# EAGLE design pcb1 (EAGLE 6.5.0)
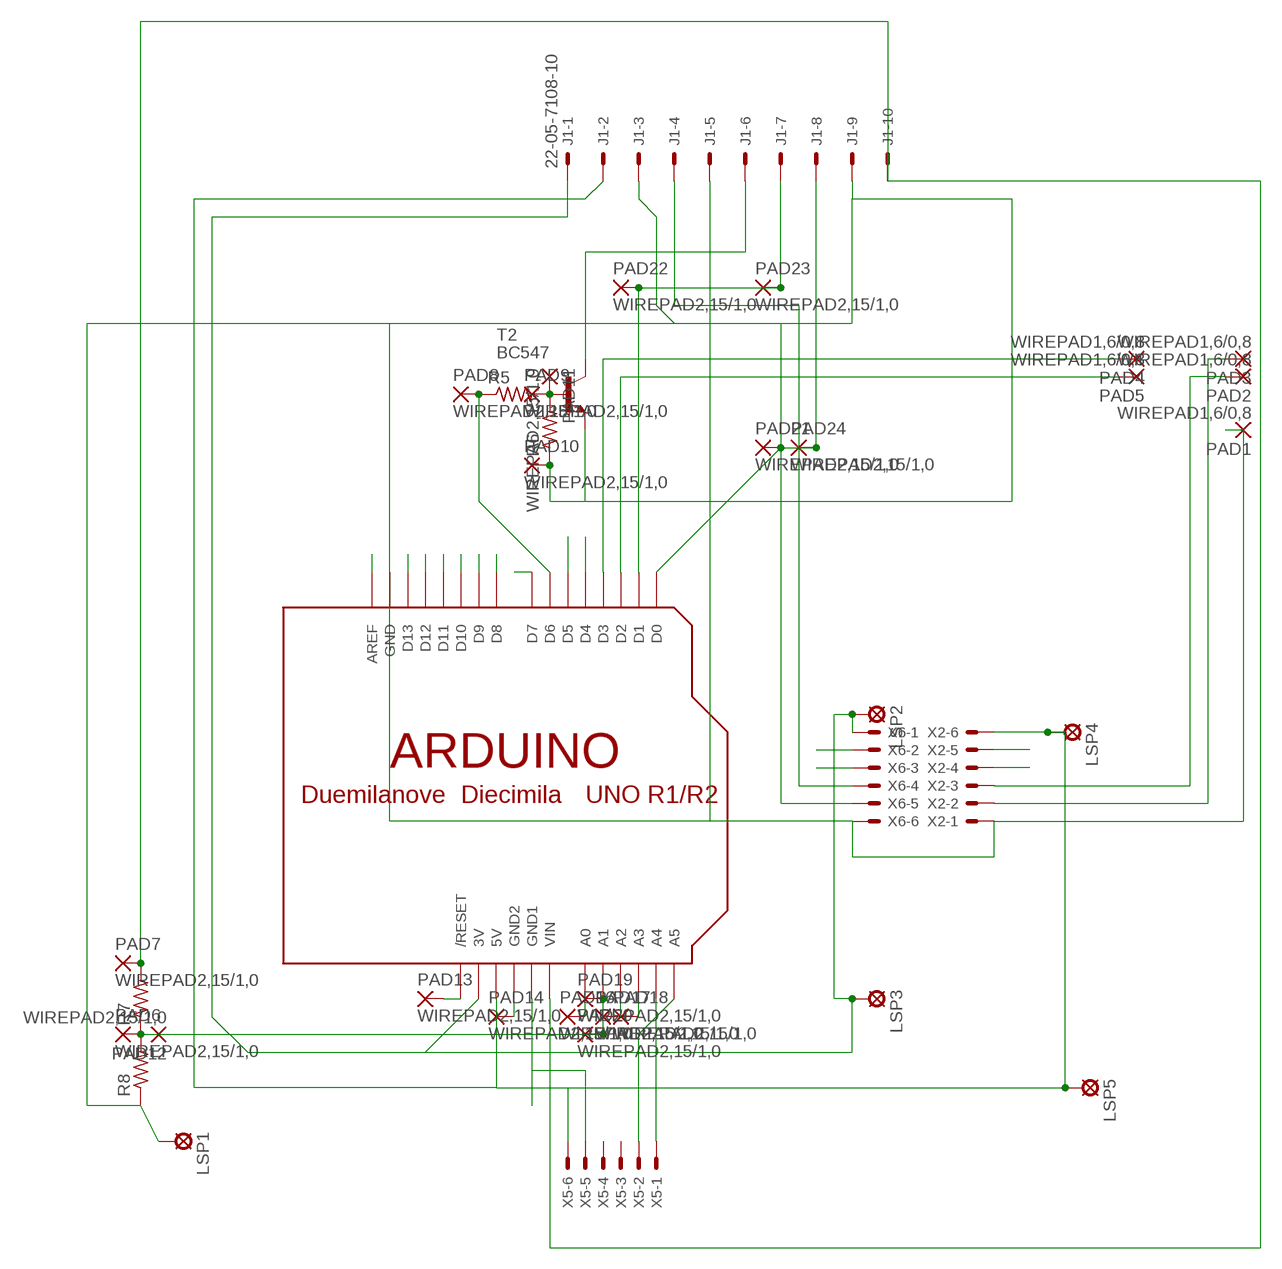
[diagram p0: schematic, sheet 1]

## Parts
J1  22-05-7108-10  [7395-10]
LSP1  LSP10  [LSP10]
LSP2  LSP10  [LSP10]
LSP3  LSP10  [LSP10]
LSP4  LSP10  [LSP10]
LSP5  LSP10  [LSP10]
PAD1  WIREPAD1,6/0,8  [1,6/0,8]
PAD2  WIREPAD1,6/0,8  [1,6/0,8]
PAD3  WIREPAD1,6/0,8  [1,6/0,8]
PAD4  WIREPAD1,6/0,8  [1,6/0,8]
PAD5  WIREPAD1,6/0,8  [1,6/0,8]
PAD6  WIREPAD2,15/1,0  [2,15/1,0]
PAD7  WIREPAD2,15/1,0  [2,15/1,0]
PAD8  WIREPAD2,15/1,0  [2,15/1,0]
PAD9  WIREPAD2,15/1,0  [2,15/1,0]
PAD10  WIREPAD2,15/1,0  [2,15/1,0]
PAD11  WIREPAD2,15/1,0  [2,15/1,0]
PAD12  WIREPAD2,15/1,0  [2,15/1,0]
PAD13  WIREPAD2,15/1,0  [2,15/1,0]
PAD14  WIREPAD2,15/1,0  [2,15/1,0]
PAD16  WIREPAD2,15/1,0  [2,15/1,0]
PAD17  WIREPAD2,15/1,0  [2,15/1,0]
PAD18  WIREPAD2,15/1,0  [2,15/1,0]
PAD19  WIREPAD2,15/1,0  [2,15/1,0]
PAD20  WIREPAD2,15/1,0  [2,15/1,0]
PAD21  WIREPAD2,15/1,0  [2,15/1,0]
PAD22  WIREPAD2,15/1,0  [2,15/1,0]
PAD23  WIREPAD2,15/1,0  [2,15/1,0]
PAD24  WIREPAD2,15/1,0  [2,15/1,0]
R5  R-US_0207/10  [0207/10]
R6  R-US_0207/10  [0207/10]
R7  R-US_0207/10  [0207/10]
R8  R-US_0207/10  [0207/10]
T2  BC547  [TO92]
U$1  ARDUINO-NODIM  [ARDUINO-NODIM]
X2  22-23-2061  [22-23-2061]
X5  22-23-2061  [22-23-2061]
X6  22-23-2061  [22-23-2061]

## Nets
N$1: U$1.GND1 X5.5
N$2: U$1.A5 X5.2
N$3: U$1.A4 X5.1
N$4: J1.6 T2.3(C)
N$8: PAD16.1(P) U$1.A0
N$9: PAD17.1(P) U$1.A2
N$10: PAD18.1(P) U$1.A3
N$11: J1.5 J1.9 LSP1.MP PAD1.1(P) PAD10.1(P) R6.1 R8.1 T2.1(E) U$1.GND X2.1 X6.6
N$12: U$1.D5
N$13: U$1.D7
N$14: PAD6.1(P) PAD12.1(P) PAD19.1(P) PAD20.1(P) R7.1 R8.2 U$1.A1
N$15: U$1.AREF
N$16: U$1.D13
N$18: J1.2 LSP4.MP LSP5.MP U$1.5V X2.6 X5.6
N$19: PAD4.1(P) U$1.D3
N$20: J1.1 LSP2.MP LSP3.MP U$1.3V X6.1
N$21: PAD5.1(P) U$1.D2
N$22: X6.3
N$23: X6.2
N$24: X2.5
N$25: J1.8 PAD21.1(P) PAD24.1(P) U$1.D0
N$26: J1.7 PAD22.1(P) PAD23.1(P) U$1.D1
N$27: PAD9.1(P) PAD11.1(P) R5.2 R6.2 T2.2(B)
N$28: X2.4
N$29: PAD8.1(P) R5.1 U$1.D6
N$30: U$1.D4
N$37: J1.4 X6.4
N$38: J1.3 X6.5
N$43: U$1.D12
N$44: U$1.D11
N$45: U$1.D10
N$46: U$1.D9
N$47: U$1.D8
N$48: PAD13.1(P) U$1.RESET(/RESET)
N$49: PAD14.1(P) U$1.GND2
N$50: J1.10 PAD7.1(P) R7.2 U$1.VIN
N$58: PAD2.1(P) X2.3
N$59: PAD3.1(P) X2.2
Unconnected: X5.3 X5.4

## Library data of the parts
J1 = con-molex:22-?-10: CONNECTOR wire to board 2.54 mm (.1 inch) pitch header; OC_FARNELL: unknown; OC_NEWARK: unknown
LSP1-LSP5 = solpad:LSP10: SOLDER PAD drill 1.0 mm, distributor Buerklin, 12H555
PAD1-PAD14 PAD16-PAD24 = wirepad:WIREPAD: Wire PAD connect wire on PCB
R5-R8 = rcl:R-US_: RESISTOR, American symbol
T2 = transistor-neu-to92:BC547: NPN TRANSISTOR
U$1 = adafruit:ARDUINO: Arduino Diecimila/Duemilanove Make a shield with ease, this package has all the named pins as well as the two mounting drill holes and an outline of the USB and DC power connector. The outline is on the DIMENSION layer, so if your board house uses it they will cut the outline to match. http://www.ladyada.net/library/pcb/eaglelibrary.html
X2 X5 X6 = con-molex:22-23-2061: .100" (2.54mm) Center Header - 6 Pin; MF: MOLEX; MPN: 22-23-2061; OC_FARNELL: 1462922; OC_NEWARK: 27C1933

## Net classes
0 default: clearance 0.205 mm

## Board
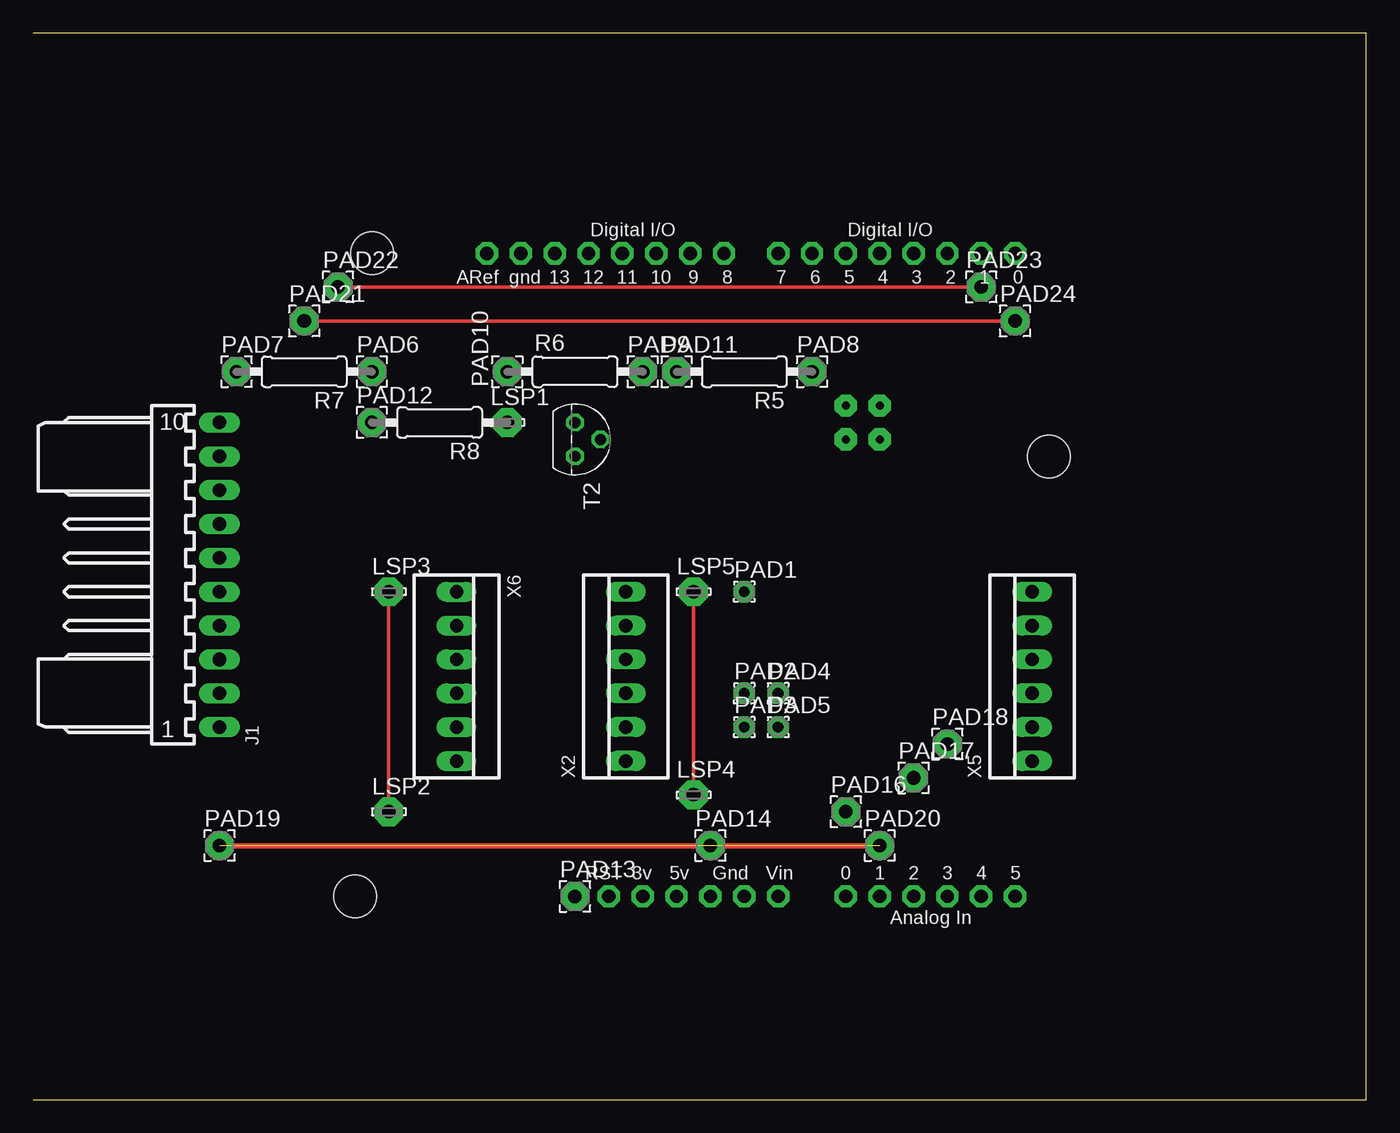
[diagram p1: board, top side]
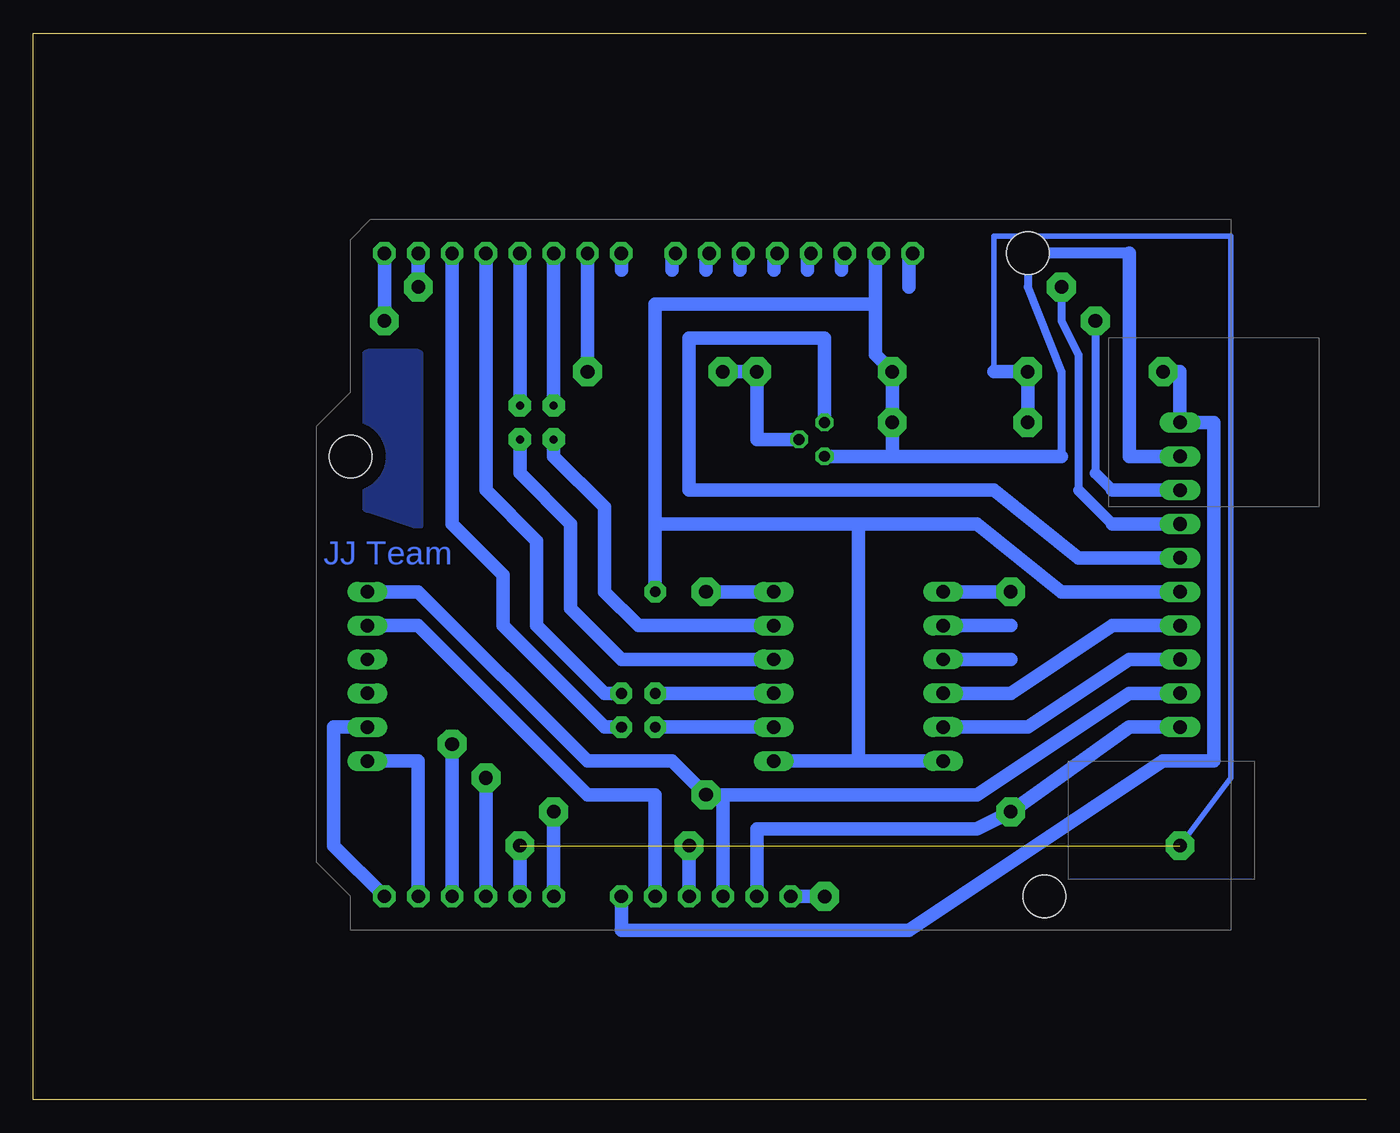
[diagram p2: board, bottom side, seen from below]

Size 100 x 80 mm. Coordinates in mm from the lower left corner, seen from the top.
Outline: 0,0 100,0 100,80 0,80
Copper layers (1*16): Top 0.035mm / dielectric 1.5mm / Bottom 0.035mm
Design rules "default": minimum track width 10mil, minimum drill 24mil, track to track 8mil, track to pad 8mil, pad to pad 8mil, via to via 8mil, smd to smd 8mil, copper to edge 40mil, drill to drill 8mil, minimum pad ring 10mil, minimum via ring 8mil, stop-mask expansion 4mil, vias tented up to drill 0mil, thermal gap 10mil

### Footprints (pad centres in the part's own frame; a part is rotated, then mirrored left to right if it is on the bottom)
7395-10 = drill 1.016 long: 1 11.43,0; 2 8.89,0; 3 6.35,0; 4 3.81,0; 5 1.27,0; 6 -1.27,0; 7 -3.81,0; 8 -6.35,0; 9 -8.89,0; 10 -11.43,0
LSP10 = drill 1.016 pad 2.159 octagon: MP 0,0
1,6/0,8 = drill 0.813 pad 1.6 octagon: 1 0,0
2,15/1,0 = drill 1.016 pad 2.159 octagon: 1 0,0
0207/10 = drill 0.813 octagon: 1 -5.08,0; 2 5.08,0
TO92 = drill 0.813 octagon: 1 1.27,0; 2 0,1.905; 3 -1.27,0
ARDUINO-NODIM = drill 1 pad 1.676 octagon: 3V 35.56,2.54; 5V 38.1,2.54; A0 50.8,2.54; A1 53.34,2.54; A2 55.88,2.54; A3 58.42,2.54; A4 60.96,2.54; A5 63.5,2.54; AREF 23.876,50.8; D0 63.5,50.8; D1 60.96,50.8; D2 58.42,50.8; D3 55.88,50.8; D4 53.34,50.8; D5 50.8,50.8; D6 48.26,50.8; D7 45.72,50.8; D8 41.656,50.8; D9 39.116,50.8; D10 36.576,50.8; D11 34.036,50.8; D12 31.496,50.8; D13 28.956,50.8; GND 26.416,50.8; GND1 43.18,2.54; GND2 40.64,2.54; RESET 33.02,2.54; VIN 45.72,2.54 | hole 3.2: 15.24,50.8; 66.04,35.56; 13.97,2.54
22-23-2061 = drill 1 long: 1 -6.35,0; 2 -3.81,0; 3 -1.27,0; 4 1.27,0; 5 3.81,0; 6 6.35,0

### Placement (x,y rotation side)
J1  13.97,39.37 270 top
LSP1  35.56,50.8 0 top
LSP2  26.67,21.59 0 top
LSP3  26.67,38.1 0 top
LSP4  49.53,22.86 0 top
LSP5  49.53,38.1 0 top
PAD1  53.34,38.1 0 top
PAD2  53.34,30.48 0 top
PAD3  53.34,27.94 0 top
PAD4  55.88,30.48 0 top
PAD5  55.88,27.94 0 top
PAD6  25.4,54.61 0 top
PAD7  15.24,54.61 0 top
PAD8  58.42,54.61 0 top
PAD9  45.72,54.61 0 top
PAD10  35.56,54.61 90 top
PAD11  48.26,54.61 0 top
PAD12  25.4,50.8 0 top
PAD13  40.64,15.24 0 top
PAD14  50.8,19.05 0 top
PAD16  60.96,21.59 0 top
PAD17  66.04,24.13 0 top
PAD18  68.58,26.67 0 top
PAD19  13.97,19.05 0 top
PAD20  63.5,19.05 0 top
PAD21  20.32,58.42 0 top
PAD22  22.86,60.96 0 top
PAD23  71.12,60.96 0 top
PAD24  73.66,58.42 0 top
R5  53.34,54.61 180 top
R6  40.64,54.61 0 top
R7  20.32,54.61 180 top
R8  30.48,50.8 180 top
T2  40.64,49.53 270 top
U$1  10.16,12.7 0 top
X2  44.45,31.75 90 top
X5  74.93,31.75 90 top
X6  31.75,31.75 270 top

### Tracks (layer width: path | path; a pad name or v marks a point on that pad's centre or on a via)
N$1
  Bottom 1.016: X5.5 71.12,35.56 58.42,22.86 53.34,22.86 U$1.GND1
N$2
  Bottom 1.016: X5.2 77.47,27.94 77.47,19.05 U$1.A5
N$3
  Bottom 1.016: X5.1 71.12,25.4 U$1.A4
N$4
  Bottom 1.016: T2.3 40.64,57.15 50.8,57.15 50.8,45.72 27.94,45.72 21.59,40.64 J1.6
N$8  (via drill 0.6)
  Bottom 1.016: PAD16.1 U$1.A0
  other vias: 60.96,21.59
N$9  (via drill 0.6)
  Bottom 1.016: PAD17.1 U$1.A2
  other vias: 66.04,24.13
N$10  (via drill 0.6)
  Bottom 1.016: PAD18.1 U$1.A3
  other vias: 68.58,26.67
N$11
  Bottom 0.254: 36.83,63.5 U$1.GND
  Bottom 0.61: 25.4,63.5 25.4,60.96 22.86,54.61 22.86,48.26
  Bottom 0.813: 17.78,63.5 25.4,63.5
  Bottom 1.016: X2.1 38.1,25.4 | 38.1,25.4 X6.6 | 38.1,43.18 53.34,43.18 | 36.83,59.69 36.83,63.5 | 36.83,59.69 53.34,59.69 53.34,43.18 | PAD1.1 53.34,43.18 | 38.1,43.18 38.1,25.4 | J1.5 22.86,38.1 29.21,43.18 38.1,43.18 | J1.9 17.78,48.26 17.78,63.5 | 22.86,48.26 35.56,48.26 | 35.56,48.26 LSP1.MP PAD10.1 36.83,55.88 36.83,59.69 | 35.56,48.26 T2.1
N$12  (via drill 0.6, 0.6 pad 1.68)
  Bottom 1.016: v60.96,52.07 U$1.D5
N$13
  Bottom 1.016: 55.88,62.23 U$1.D7
N$14  (via drill 0.6)  (2 unrouted)
  Top 0.406: PAD20.1 PAD19.1
  Bottom 0.406: 27.94,54.61 27.94,64.77 10.16,64.77 10.16,24.13 PAD19.1
  Bottom 1.016: PAD20.1 U$1.A1 | PAD12.1 PAD6.1 27.94,54.61
  other vias: 63.5,19.05 13.97,19.05
N$18  (via drill 0.6)
  Top 0.254: LSP4.MP LSP5.MP
  Bottom 1.016: U$1.5V 48.26,22.86 | X5.6 71.12,38.1 58.42,25.4 52.07,25.4 LSP4.MP 48.26,22.86 | J1.2 17.78,30.48 29.21,22.86 48.26,22.86 | LSP5.MP X2.6
  other vias: 49.53,22.86 49.53,38.1
N$19
  Bottom 1.016: PAD4.1 57.15,30.48 62.23,35.56 62.23,41.91 66.04,45.72 U$1.D3
N$20  (via drill 0.6)
  Top 0.254: LSP2.MP LSP3.MP
  Bottom 1.016: LSP3.MP X6.1 | J1.1 17.78,27.94 LSP2.MP 29.21,20.32 45.72,20.32 U$1.3V
  other vias: 26.67,21.59 26.67,38.1
N$21
  Bottom 1.016: U$1.D2 68.58,43.18 64.77,39.37 64.77,35.56 57.15,27.94 PAD5.1
N$22
  Bottom 1.016: 26.67,33.02 X6.3
N$23
  Bottom 1.016: X6.2 26.67,35.56
N$24  (via drill 0.6, 0.6 pad 1.68)
  Bottom 1.016: X2.5 54.61,35.56 57.15,38.1 57.15,44.45 60.96,48.26 v60.96,49.53
N$25  (via drill 0.6)
  Top 0.254: PAD24.1 PAD21.1
  Bottom 0.61: PAD21.1 20.32,46.99
  Bottom 0.813: 20.32,46.99 19.05,45.72
  Bottom 1.016: 19.05,45.72 J1.8 | U$1.D0 PAD24.1
  other vias: 73.66,58.42 20.32,58.42
N$26  (via drill 0.6)
  Top 0.254: PAD23.1 PAD22.1
  Bottom 0.61: PAD22.1 22.86,58.42 21.59,55.88 21.59,45.72
  Bottom 0.813: 21.59,45.72 19.05,43.18
  Bottom 1.016: 19.05,43.18 J1.7 | U$1.D1 PAD23.1
  other vias: 71.12,60.96 22.86,60.96
N$27
  Bottom 1.016: T2.2 45.72,49.53 PAD9.1 PAD11.1
N$28  (via drill 0.6, 0.6 pad 1.68)
  Bottom 1.016: X2.4 55.88,33.02 59.69,36.83 59.69,43.18 63.5,46.99 v63.5,49.53
N$29
  Bottom 1.016: U$1.D6 PAD8.1
N$30  (via drill 0.6, 0.6 pad 1.68)
  Bottom 1.016: v63.5,52.07 U$1.D4
N$37
  Bottom 1.016: X6.4 26.67,30.48 19.05,35.56 J1.4
N$38
  Bottom 1.016: X6.5 25.4,27.94 17.78,33.02 J1.3
N$42
  pour Bottom: 71.12,55.88 74.93,55.88 74.93,44.45 71.12,43.18
N$48
  Bottom 1.016: PAD13.1 U$1.RESET
N$49
  Bottom 1.016: PAD14.1 U$1.GND2
N$50
  Bottom 1.016: PAD7.1 13.97,54.61 J1.10 11.43,50.8 11.43,25.4 15.24,25.4 34.29,12.7 55.88,12.7 U$1.VIN
N$51
  Bottom 1.016: 34.29,60.96 34.29,63.5
N$52
  Bottom 1.016: 39.37,62.23 39.37,63.5
N$53
  Bottom 1.016: 41.91,62.23 41.91,63.5
N$54
  Bottom 1.016: 44.45,62.23 44.45,63.5
N$55
  Bottom 1.016: 46.99,62.23 46.99,63.5
N$56
  Bottom 1.016: 49.53,62.23 49.53,63.5
N$57
  Bottom 1.016: 52.07,62.23 52.07,63.5
N$58
  Bottom 1.016: PAD2.1 X2.3
N$59
  Bottom 1.016: PAD3.1 X2.2

### Text on the board
Bottom: JJ Team